# EAGLE design SerialDev-2232-1A (EAGLE 7.3.0)
Assembly variants: ScreenWatch, ScreenCheck, ScreenWatchEco, SX2-BMG
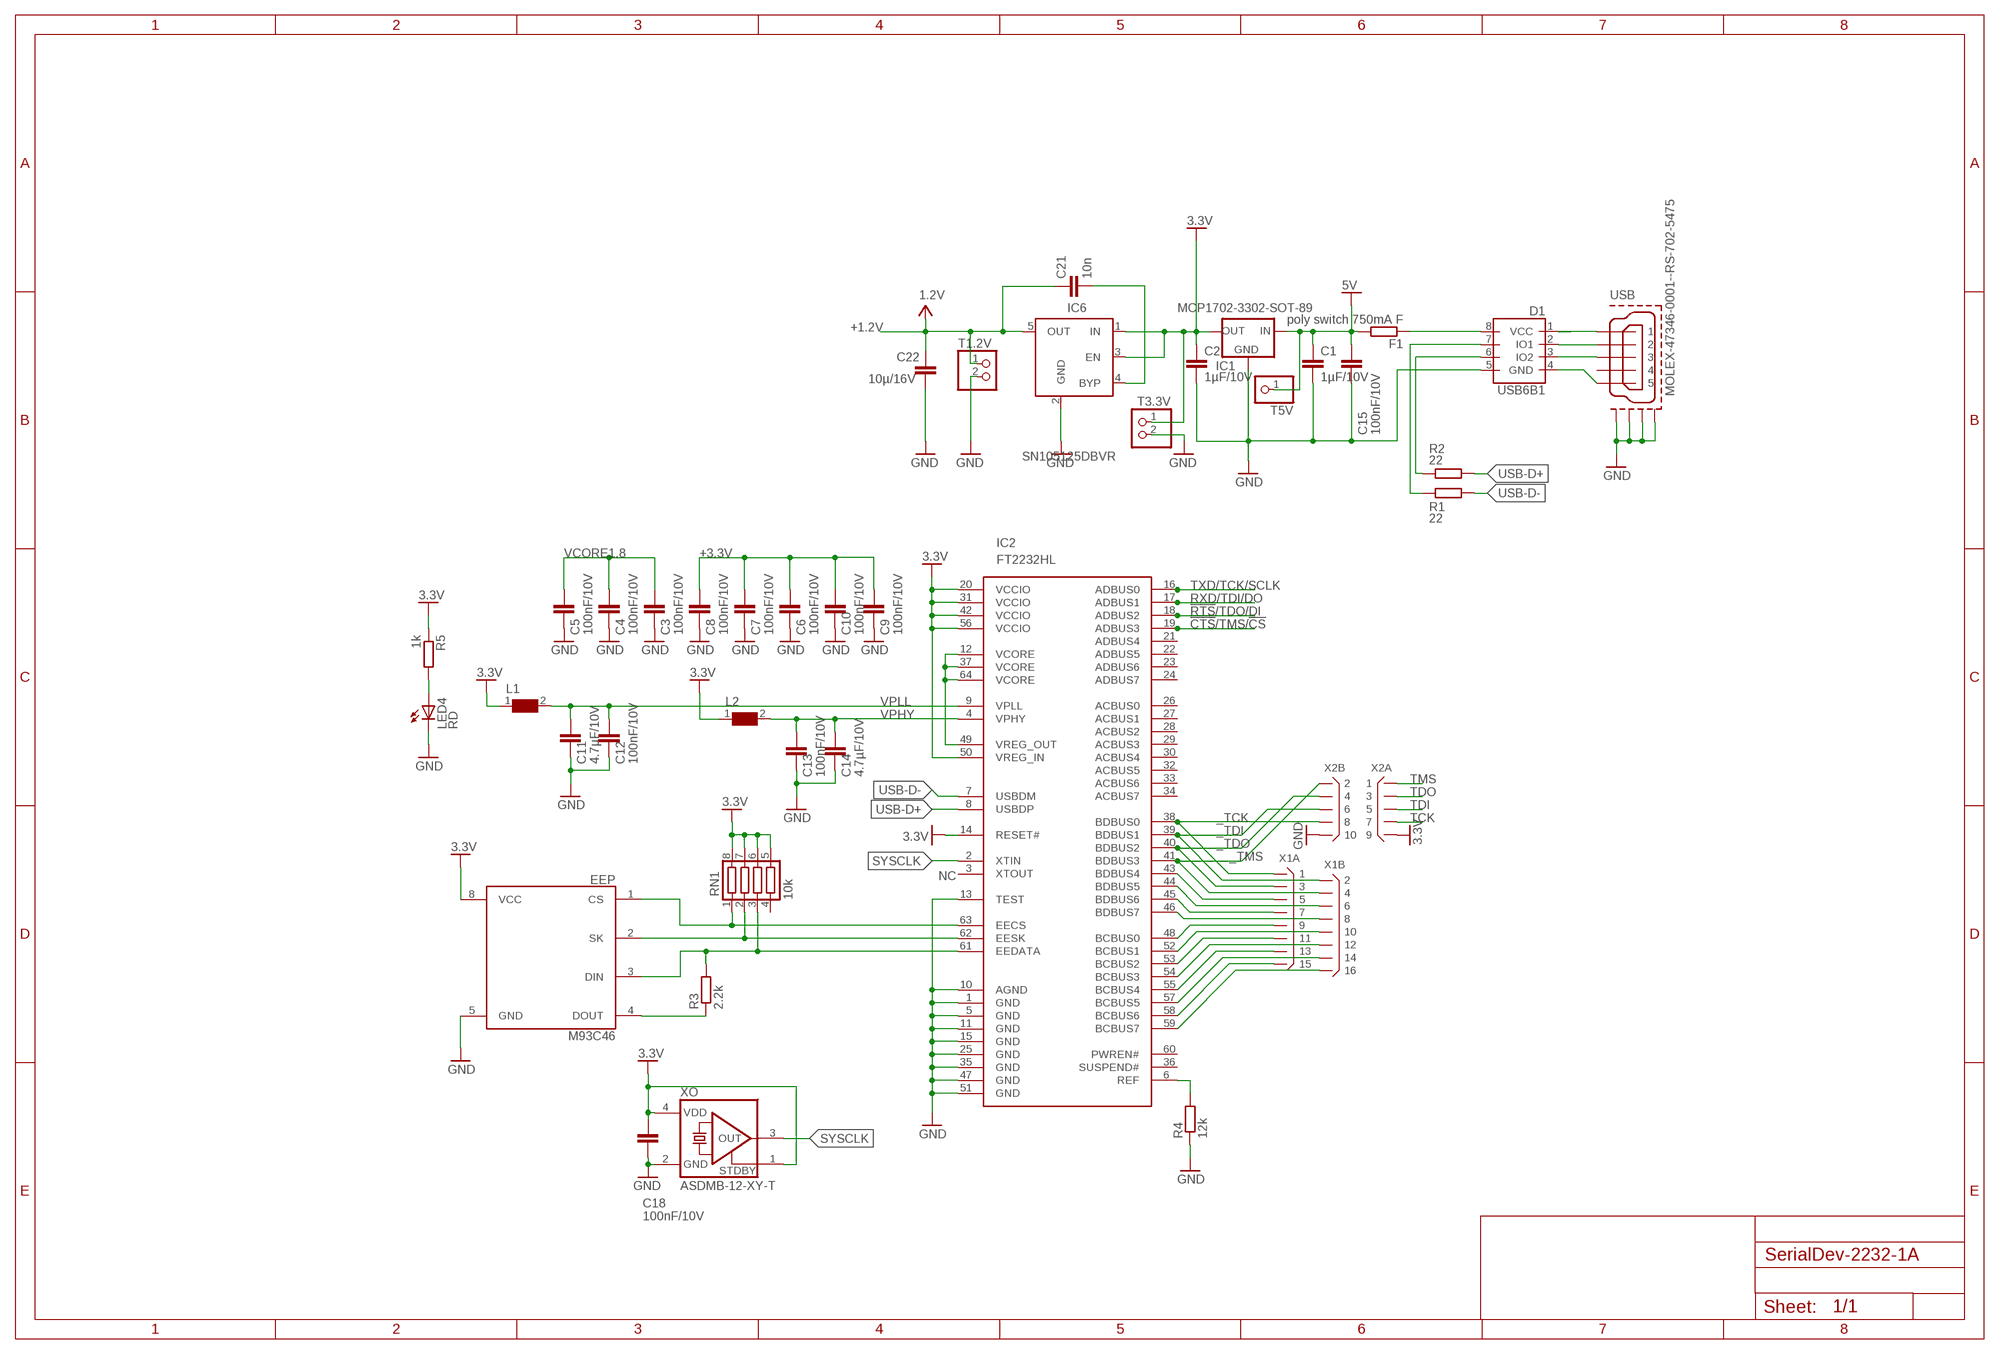
[diagram p0: schematic, sheet 1]

## Parts
C1  1µF/10V  C-EUC0805K  [C0805K]  (not fitted in variant ScreenCheck)  (not fitted in variant SX2-BMG)
C2  1µF/10V  C-EUC0805K  [C0805K]
C3  100nF/10V  C-EUC0402K  [C0402K]
C4  100nF/10V  C-EUC0402K  [C0402K]
C5  100nF/10V  C-EUC0402K  [C0402K]
C6  100nF/10V  C-EUC0402K  [C0402K]
C7  100nF/10V  C-EUC0402K  [C0402K]
C8  100nF/10V  C-EUC0402K  [C0402K]
C9  100nF/10V  C-EUC0402K  [C0402K]
C10  100nF/10V  C-EUC0402K  [C0402K]
C11  4.7µF/10V  C-EUC0402K  [C0402K]
C12  100nF/10V  C-EUC0402K  [C0402K]
C13  100nF/10V  C-EUC0402K  [C0402K]
C14  4.7µF/10V  C-EUC0402K  [C0402K]
C15  100nF/10V  C-EUC0402K  [C0402K]
C18  100nF/10V  C-EUC0402K  [C0402K]
C21  10n  C-EUC0805K  [C0805K]
C22  10µ/16V  C-EUC0805K  [C0805K]
D1  USB6B1  [SO08]
EEP  M93C46  [SO08]
F1  poly switch 750mA F  R-EU_R1206  [R1206]
IC1  MCP1702-3302-SOT-89  [SOT89-R]  (not fitted in variant ScreenCheck)  (not fitted in variant SX2-BMG)
IC2  FT2232HL  [LQFP-ST-64-2]
IC6  SN105125DBVR  MIC5219XX  [SOT23-5]
L1  WE-CBF_0603  [0603]
L2  WE-CBF_0603  [0603]
LED4  RD  LEDCHIP-LED0805  [CHIP-LED0805]  (not fitted in variant ScreenWatch)  (not fitted in variant ScreenWatchEco)
R1  22  R-EU_R0603  [R0603]  (not fitted in variant ScreenWatch)  (not fitted in variant ScreenWatchEco)
R2  22  R-EU_R0603  [R0603]  (not fitted in variant ScreenWatch)  (not fitted in variant ScreenWatchEco)
R3  2.2k  R-EU_R0603  [R0603]
R4  12k  R-EU_R0603  [R0603]
R5  1k  R-EU_R0603  [R0603]  (not fitted in variant ScreenWatch)  (not fitted in variant ScreenWatchEco)
RN1  10k  CTS742C083  [CTS742C083]
T1.2V  PINHD-1X2  [1X02]
T3.3V  PINHD-1X2  [1X02]
T5V  PINHD-1X1  [1X01]
USB  MOLEX-47346-0001--RS-702-5475  MOLEX-47346-0001  [MOLEX-47364-0001]  (not fitted in variant ScreenWatch)  (not fitted in variant ScreenWatchEco)  (not fitted in variant SX2-BMG)
X1  X08X2IR  [X16R-IDC]
X2  X05X2DR  [X10R-DIL]
XO  ASDMB-12-XY-T  XTAL-ASDMB  [XO-4-2.5X2.0]

## Nets
!CTS!/TMS/!CS!: IC2.19(ADBUS3)
!RTS!/TDO/DI: IC2.18(ADBUS2)
+1.2V: C21.1 C22.1 IC6.5(OUT) T1.2V.1 ; supply symbol labelled 1.2V
+3.3V: C2.1 C6.1 C7.1 C8.1 C9.1 C10.1 C18.1 EEP.8(VCC) IC1.3(OUT) IC2.14(RESET#) IC2.20(VCCIO) IC2.31(VCCIO) IC2.42(VCCIO) IC2.50(VREG_IN) IC2.56(VCCIO) IC6.1(IN) IC6.3(EN) L1.1 L2.1 R5.1 RN1.5 RN1.6 RN1.7 RN1.8 T3.3V.1 X2.9 XO.1(TRI) XO.4(VDD) ; supply symbol labelled 3.3V
+5V: C1.1 C15.1 F1.2 IC1.2(IN) IC1.4(IN) T5V.1 ; supply symbol labelled 5V
_TCK: IC2.38(BDBUS0) X1.1 X2.8
_TDI: IC2.39(BDBUS1) X1.2 X2.6
_TDO: IC2.40(BDBUS2) X1.3 X2.4
_TMS: IC2.41(BDBUS3) X1.4 X2.2
GND [copper pour GND]: C1.2 C2.2 C3.2 C4.2 C5.2 C6.2 C7.2 C8.2 C9.2 C10.2 C11.2 C12.2 C13.2 C14.2 C15.2 C18.2 C22.2 D1.5(GND) EEP.5(GND) IC1.1(GND) IC2.1(GND) IC2.5(GND) IC2.10(AGND) IC2.11(GND) IC2.13(TEST) IC2.15(GND) IC2.25(GND) IC2.35(GND) IC2.47(GND) IC2.51(GND) IC6.2(GND) LED4.C R4.1 T1.2V.2 T3.3V.2 USB.GND1 USB.GND2 USB.GND3 USB.GND4 X2.10 XO.2(GND)
N$1: EEP.1(CS) IC2.63(EECS) RN1.1
N$2 [USB]: D1.6(IO2) R2.1
N$3 [USB]: D1.7(IO1) R1.2
N$4: EEP.2(SK) IC2.62(EESK) RN1.2
N$5: EEP.3(DIN) IC2.61(EEDATA) R3.2 RN1.3
N$6: EEP.4(DOUT) R3.1
N$7: D1.4(GND) USB.5
N$8: D1.3(IO2) USB.3
N$9: IC2.6(REF) R4.2
N$10: D1.2(IO1) USB.2
N$11: D1.8(VCC) F1.1
N$12: C21.2 IC6.4(BYP)
N$14: LED4.A R5.2
N$18: IC2.43(BDBUS4) X1.5
N$19: IC2.44(BDBUS5) X1.6
N$20: IC2.45(BDBUS6) X1.7
N$21: IC2.46(BDBUS7) X1.8
N$22: IC2.48(BCBUS0) X1.9
N$23: IC2.52(BCBUS1) X1.10
N$24: IC2.53(BCBUS2) X1.11
N$25: IC2.54(BCBUS3) X1.12
N$26: IC2.55(BCBUS4) X1.13
N$27: IC2.57(BCBUS5) X1.14
N$28: IC2.58(BCBUS6) X1.15
N$29: IC2.59(BCBUS7) X1.16
RXD/TDI/DO: IC2.17(ADBUS1)
SYSCLK: IC2.2(XTIN) XO.3(OUT)
TCK: X2.7
TDI: X2.5
TDO: X2.3
TMS: X2.1
TXD/TCK/SCLK: IC2.16(ADBUS0)
USB-D+ [USB]: IC2.8(USBDP) R2.2
USB-D- [USB]: IC2.7(USBDM) R1.1
USB_5V: D1.1(VCC) USB.1
VCORE1.8: C3.1 C4.1 C5.1 IC2.12(VCORE) IC2.37(VCORE) IC2.49(VREG_OUT) IC2.64(VCORE)
VPHY: C13.1 C14.1 IC2.4(VPHY) L2.2
VPLL: C11.1 C12.1 IC2.9(VPLL) L1.2
Unconnected: IC2.3(XTOUT) IC2.21(ADBUS4) IC2.22(ADBUS5) IC2.23(ADBUS6) IC2.24(ADBUS7) IC2.26(ACBUS0) IC2.27(ACBUS1) IC2.28(ACBUS2) IC2.29(ACBUS3) IC2.30(ACBUS4) IC2.32(ACBUS5) IC2.33(ACBUS6) IC2.34(ACBUS7) IC2.36(SUSPEND#) IC2.60(PWREN#) RN1.4 USB.4

## Notes on the sheet
- NC

## Library data of the parts
C1 C2 = rcl:C-EU: CAPACITOR, European symbol
C3-C15 C18 = rcl:C-EU: CAPACITOR, European symbol; MOUSER: 810-C1005X7R1H104K
C21 = rcl:C-EU: CAPACITOR, European symbol; PARTNO: Kemet: C1206C103K5RACTU; VALUE2: 50V/X7R; VALUE3: Farnell: 1414713
C22 = rcl:C-EU: CAPACITOR, European symbol; PARTNO: Vishay Sprague: TR3B106K016C0800; VALUE2: 16V/10%; VALUE3: Farnell: 1754085; VALUE4: Wird mit Bauform B bestückt
D1 = st-microelectronics:USB6B1: DATA LINES PROTECTION Source: http://www.st.com/stonline/products/literature/ds/5605.pdf; MPN: USB6B1; OC_FARNELL: 9804358; OC_NEWARK: 26M4750
EEP = SparkFun-DigitalIC:M93C46: 1kbit SPI EEPROM
F1 R1-R5 = rcl:R-EU_: RESISTOR, European symbol
IC1 = MCP1702:MCP1702-
IC2 = custom-parts:FT2232H: FT2232H DUAL HIGH SPEED USB TO MULTIPURPOSE UART/FIFO IC Datasheet http://www.ftdichip.com/Documents/DataSheets/ICs/DS_FT2232H.pdf; FARNELL: 1697461; MOUSER: 895-FT2232HL
IC6 = v-reg-micrel:MIC5219XX: VOLTAGE REGULATOR; PARTNO: LINEAR TECHNOLOGY: LT1761ES5-1.2; VALUE3: Farnell: 2102605
L1 L2 = EagleLibrary_Wuerth_Elektronik_eiSos_V6_20140807:WE-CBF: SMD EMI Suppression Ferrite Beads WE-CBF - Excellent anti-EMI properties - Low DC-restistance - Impedances till 3000 ohms - Rated current up to 6 A -- Reliable Ni-Sn electrodes -- Perfect as data lined filter and for uncoupling of distribution voltage <http://katalog.we-online.de/media/images/eisos/FeCBF_pf2.jpg> Details see: http://katalog.we-online.de/en/pbs/WE-CBF updated by Dan Xu 2014-06-19 2014 (C) Würth Elektronik
LED4 = led:LED: LED OSRAM: - CHIPLED LG R971, LG N971, LY N971, LG Q971, LY Q971, LO R971, LY R971 LH N974, LH R974 LS Q976, LO Q976, LY Q976 LO Q996 - Hyper CHIPLED LW Q18S LB Q993, LB Q99A, LB R99A - SideLED LS A670, LO A670, LY A670, LG A670, LP A670 LB A673, LV A673, LT A673, LW A673 LH A674 LY A675 LS A676, LA A676, LO A676, LY A676, LW A676 LS A679, LY A679, LG A679 - Hyper Micro SIDELED® LS Y876, LA Y876, LO Y876, LY Y876 LT Y87S - SmartLED LW L88C, LW L88S LB L89C, LB L89S, LG L890 LS L89K, LO L89K, LY L89K LS L896, LA L896, LO L896, LY L896 - TOPLED LS T670, LO T670, LY T670, LG T670, LP T670 LSG T670, LSP T670, LSY T670, LOP T670, LYG T670 LG T671, LOG T671, LSG T671 LB T673, LV T673, LT T673, LW T673 LH T674 LS T676, LA T676, LO T676, LY T676, LB T676, LH T676, LSB T676, LW T676 LB T67C, LV T67C, LT T67C, LS T67K, LO T67K, LY T67K, LW E67C LS E67B, LA E67B, LO E67B, LY E67B, LB E67C, LV E67C, LT E67C LW T67C LS T679, LY T679, LG T679 LS T770, LO T770, LY T770, LG T770, LP T770 LB T773, LV T773, LT T773, LW T773 LH T774 LS E675, LA E675, LY E675, LS T675 LS T776, LA T776, LO T776, LY T776, LB T776 LHGB T686 LT T68C, LB T68C - Hyper Mini TOPLED® LB M676 - Mini TOPLED Santana® LG M470 LS M47K, LO M47K, LY M47K Source: http://www.osram.convergy.de LUXEON: - LUMILED® LXK2-PW12-R00, LXK2-PW12-S00, LXK2-PW14-U00, LXK2-PW14-V00 LXK2-PM12-R00, LXK2-PM12-S00, LXK2-PM14-U00 LXK2-PE12-Q00, LXK2-PE12-R00, LXK2-PE12-S00, LXK2-PE14-T00, LXK2-PE14-U00 LXK2-PB12-K00, LXK2-PB12-L00, LXK2-PB12-M00, LXK2-PB14-N00, LXK2-PB14-P00, LXK2-PB14-Q00 LXK2-PR12-L00, LXK2-PR12-M00, LXK2-PR14-Q00, LXK2-PR14-R00 LXK2-PD12-Q00, LXK2-PD12-R00, LXK2-PD12-S00 LXK2-PH12-R00, LXK2-PH12-S00 LXK2-PL12-P00, LXK2-PL12-Q00, LXK2-PL12-R00 Source: www.luxeon.com KINGBRIGHT: KA-3528ASYC Source: www.kingbright.com
RN1 = resistor-net:CTS742C083: Chip Resistor Array 4 Single Resistor Source: http://www.ctscorp.com/components/Datasheets/CTSChipArrayDs.pdf; OC_FARNELL: unknown; OC_NEWARK: unknown
T1.2V T3.3V = pinhead:PINHD-1X2: PIN HEADER
T5V = pinhead:PINHD-1X1: PIN HEADER
USB = usb_con-update:MOLEX-47346-0001: MICRO USB B, BOTTOM MOUNT
X1 = connectors:X08X2: Connector 2x8 pins
X2 = connectors:X05X2: Connector 2x5 pins
XO = custom-parts:XTAL: INDUSTRIAL GRADE ULTRA MINIATURE 7.0 x 5.0 x 0.85 mm PURE SILICONTM CLOCK OSCILLATOR Features Pure Silicon™ Clock Oscillator 2nd Generation MEMS Technology with reduced jitter by Discera Low Power Consumption <10mA Exceptional Stability +/- 10ppm Over Temp. at -40 to +105°C Capable of surviving up-to 30kg Mechanical Shock (see note #1) Compact QFN Plastic Packaging Datasheet http://www.mouser.com/ds/2/3/ASVMB-35165.pdf; MFG: ABRACON; MFG_PARTNO: ASDMB-12.000MHZ-XY-T; MOUSER: 815-ASDMB-12-XY-T

## Net classes
0 default: width 0.2 mm, drill 0.3 mm, clearance 0.15 mm
1 copper pour GND: width 0.2 mm, drill 0.3 mm, clearance 0.15 mm to class 0, clearance 0.15 mm
2 copper pour +5V: width 0.2 mm, drill 0.3 mm, clearance 0.15 mm to class 0, clearance 0.15 mm to class 1, clearance 0.15 mm
3 USB: width 0.203 mm, drill 0.3 mm, clearance 0.508 mm to class 0, clearance 0.508 mm to class 1, clearance 0.508 mm to class 2, clearance 0.305 mm

## Board
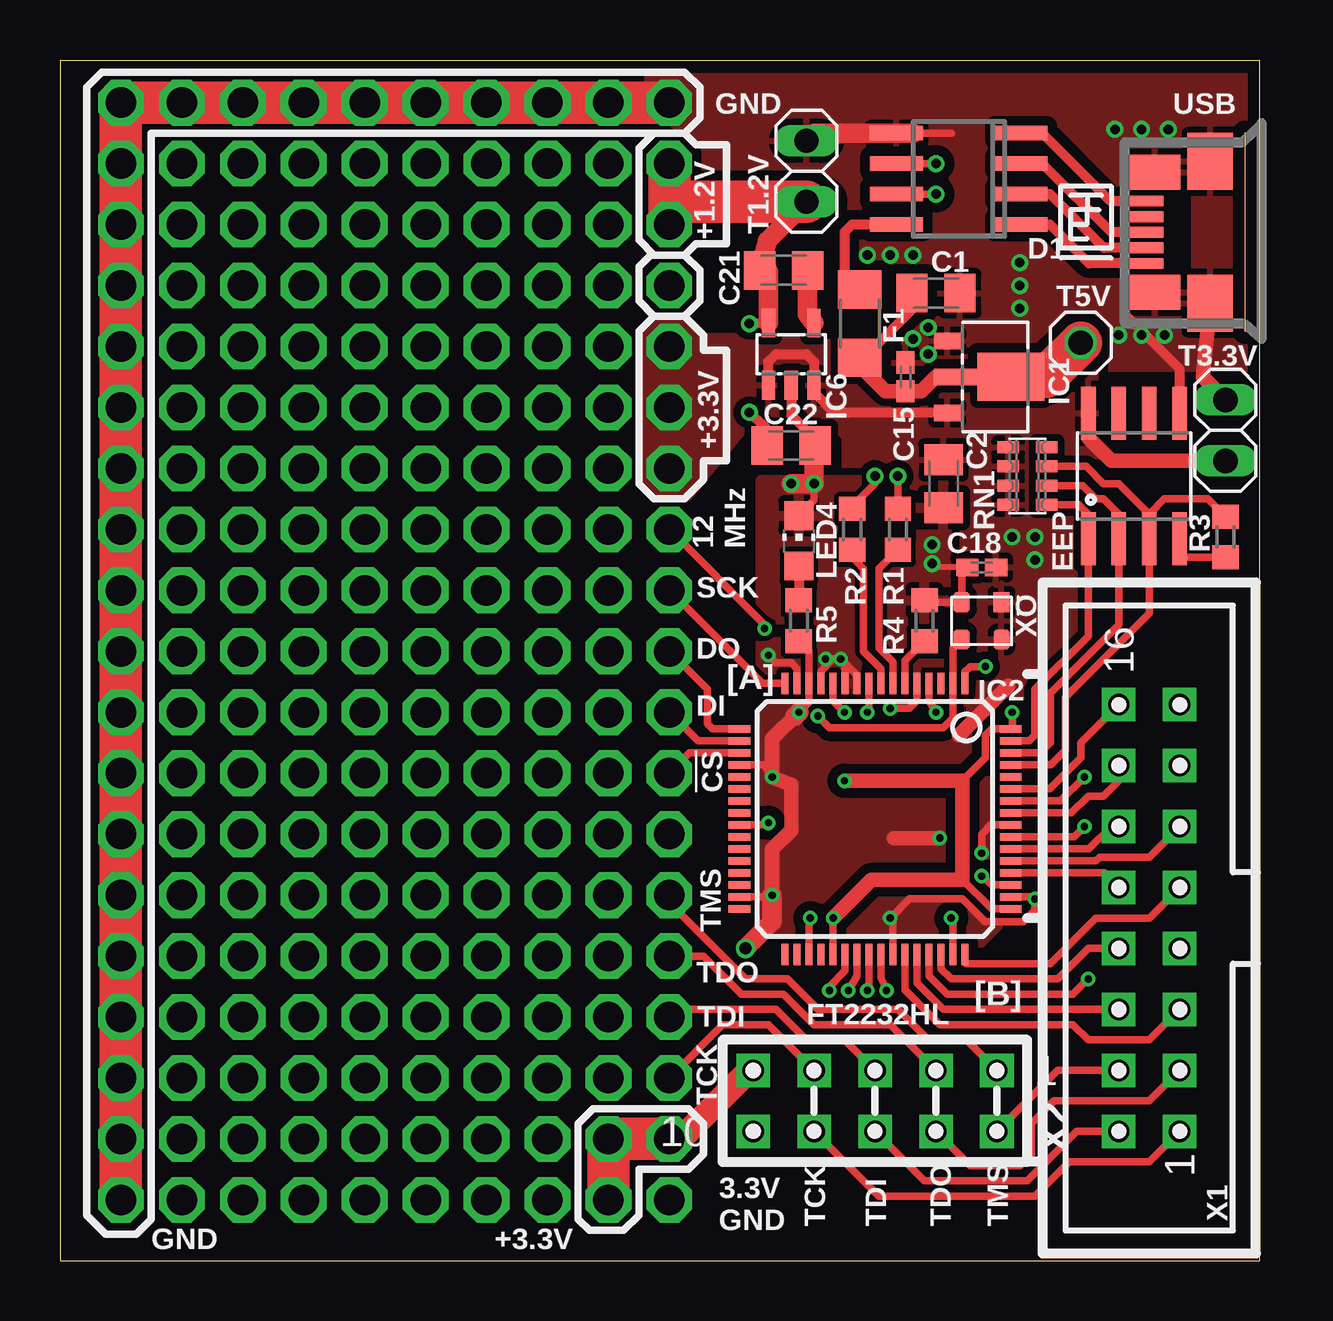
[diagram p1: board, top side]
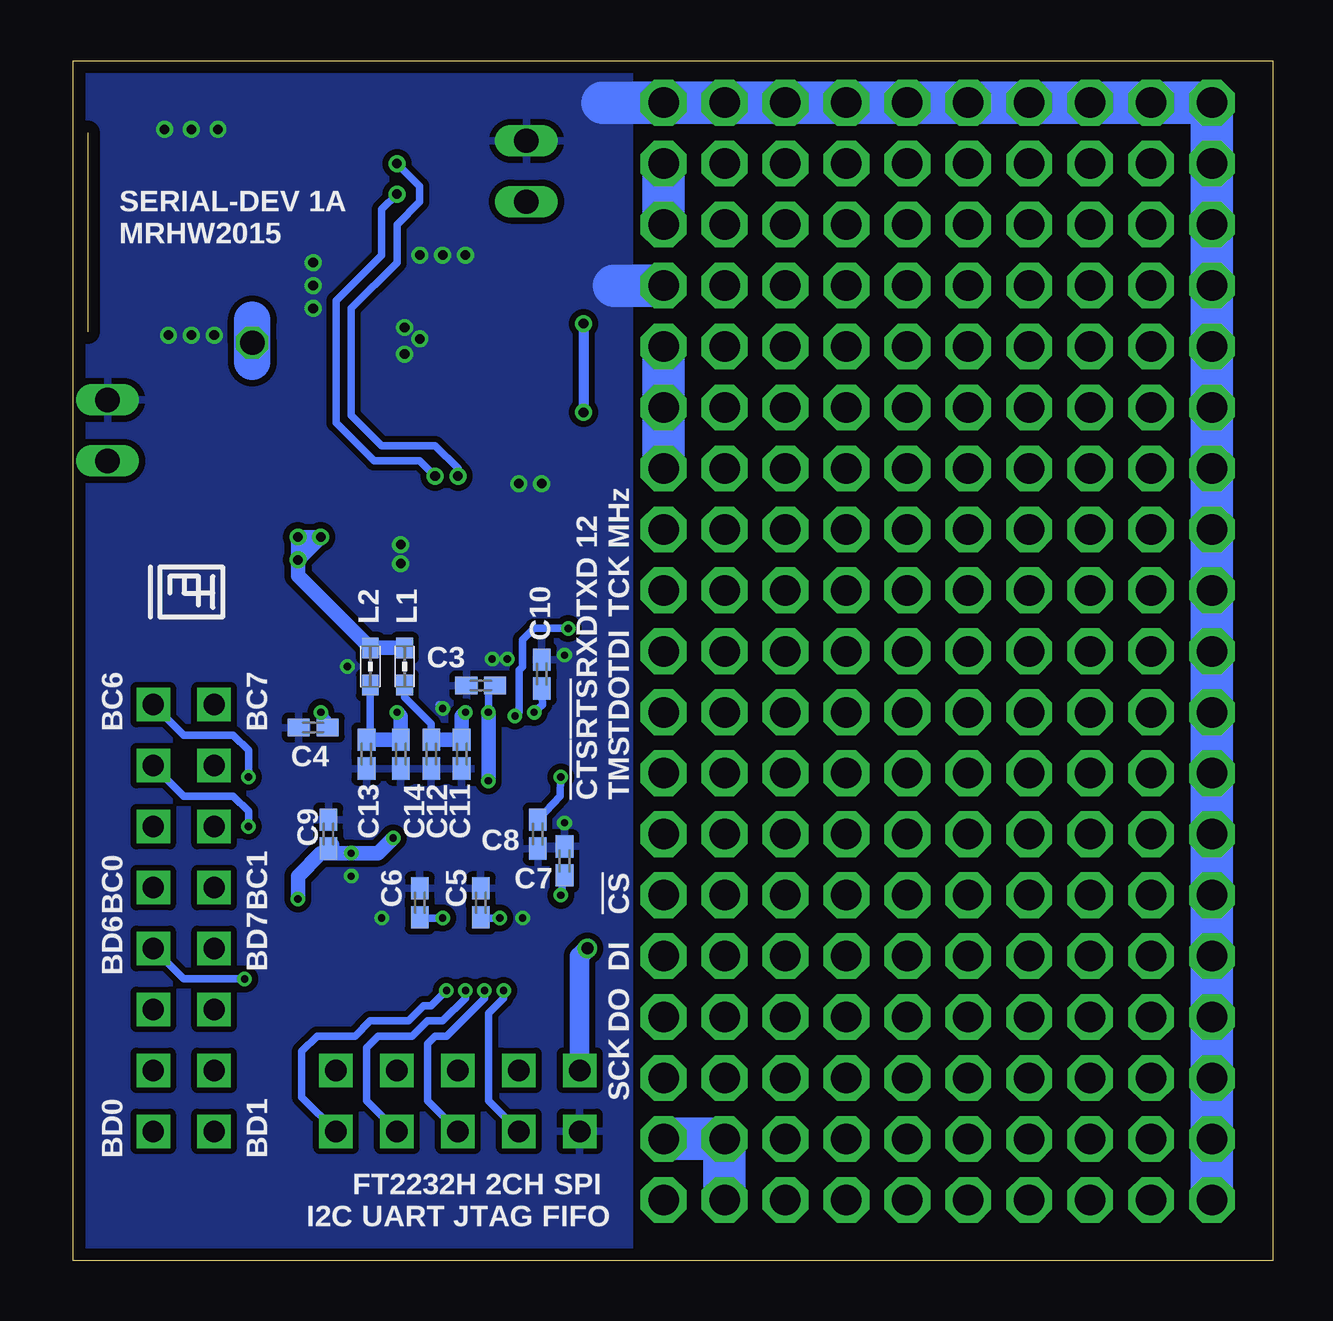
[diagram p2: board, bottom side, seen from below]

Size 50 x 50 mm. Coordinates in mm from the lower left corner, seen from the top.
Outline: 0,0 50,0 50,50 0,50 0,0
Copper layers (1*16): Top 0.035mm / dielectric 1.5mm / Bottom 0.035mm
Design rules "default *": minimum track width 10mil, minimum drill 0.3mm, track to track 8mil, track to pad 8mil, pad to pad 8mil, via to via 8mil, smd to smd 8mil, copper to edge 20mil, drill to drill 8mil, minimum pad ring 6mil, minimum via ring 6mil, stop-mask expansion 1mil, vias tented up to drill 0.4mm, thermal gap 10mil

### Footprints (pad centres in the part's own frame; a part is rotated, then mirrored left to right if it is on the bottom)
C0805K = smd 1.3 x 1.6: 1 -1,0; 2 1,0
C0402K = smd 0.925 x 0.74: 1 -0.6,0; 2 0.6,0
SO08 = smd 0.6 x 2.2: 1 -1.905,-2.6; 2 -0.635,-2.6; 3 0.635,-2.6; 4 1.905,-2.6; 5 1.905,2.6; 6 0.635,2.6; 7 -0.635,2.6; 8 -1.905,2.6
SO08' = smd 0.61 x 2.21: 1 -1.905,-2.616; 2 -0.635,-2.616; 3 0.635,-2.616; 4 1.905,-2.616; 5 1.905,2.616; 6 0.635,2.616; 7 -0.635,2.616; 8 -1.905,2.616
R1206 = smd 1.6 x 1.803: 1 -1.422,0; 2 1.422,0
SOT89-R = smd 0.7 x 1.1: 1 -1.5,-1.75; 3 1.5,-1.75 | smd 0.7 x 1.8: 2 0,-1.4 | smd 2 x 2.8: 4 0,0.9
LQFP-ST-64-2 = smd 0.9 x 0.3: 1 -5.65,3.75; 2 -5.65,3.25; 3 -5.65,2.75; 4 -5.65,2.25; 5 -5.65,1.75; 6 -5.65,1.25; 7 -5.65,0.75; 8 -5.65,0.25; 9 -5.65,-0.25; 10 -5.65,-0.75; 11 -5.65,-1.25; 12 -5.65,-1.75; 13 -5.65,-2.25; 14 -5.65,-2.75; 15 -5.65,-3.25; 16 -5.65,-3.75; 33 5.65,-3.75; 34 5.65,-3.25; 35 5.65,-2.75; 36 5.65,-2.25; 37 5.65,-1.75; 38 5.65,-1.25; 39 5.65,-0.75; 40 5.65,-0.25; 41 5.65,0.25; 42 5.65,0.75; 43 5.65,1.25; 44 5.65,1.75; 45 5.65,2.25; 46 5.65,2.75; 47 5.65,3.25; 48 5.65,3.75 | smd 0.3 x 0.9: 17 -3.75,-5.65; 18 -3.25,-5.65; 19 -2.75,-5.65; 20 -2.25,-5.65; 21 -1.75,-5.65; 22 -1.25,-5.65; 23 -0.75,-5.65; 24 -0.25,-5.65; 25 0.25,-5.65; 26 0.75,-5.65; 27 1.25,-5.65; 28 1.75,-5.65; 29 2.25,-5.65; 30 2.75,-5.65; 31 3.25,-5.65; 32 3.75,-5.65; 49 3.75,5.65; 50 3.25,5.65; 51 2.75,5.65; 52 2.25,5.65; 53 1.75,5.65; 54 1.25,5.65; 55 0.75,5.65; 56 0.25,5.65; 57 -0.25,5.65; 58 -0.75,5.65; 59 -1.25,5.65; 60 -1.75,5.65; 61 -2.25,5.65; 62 -2.75,5.65; 63 -3.25,5.65; 64 -3.75,5.65
SOT23-5 = smd 0.55 x 1.2: 1 -0.95,-1.3; 2 0,-1.3; 3 0.95,-1.3; 4 0.95,1.3; 5 -0.95,1.3
0603 = smd 0.85 x 0.7: 1 -0.775,0; 2 0.775,0
CHIP-LED0805 = smd 1.2 x 1.2: A 0,-1.05; C 0,1.05
R0603 = smd 1 x 1.1: 1 -0.85,0; 2 0.85,0
CTS742C083 = smd 0.5 x 0.9: 1 -1.2,-0.8; 2 -0.4,-0.8; 3 0.4,-0.8; 4 1.2,-0.8; 5 1.2,0.8; 6 0.4,0.8; 7 -0.4,0.8; 8 -1.2,0.8
1X02 = drill 1.016 long: 1 -1.27,0; 2 1.27,0
1X01 = drill 1.016 octagon: 1 0,0
MOLEX-47364-0001 = smd 1.7 x 0.45: 1 2.8,1.3; 2 2.8,0.65; 3 2.8,0; 4 2.8,-0.65; 5 2.8,-1.3 | smd 1.9 x 2.375: GND1 0,2.95; GND4 0,-2.95 | smd 2.1 x 1.475: GND2 2.3,2.5; GND3 2.3,-2.5
X16R-IDC = drill 0.889 pad 1.397 square: 1 -8.89,-1.27; 2 -8.89,1.27; 3 -6.35,-1.27; 4 -6.35,1.27; 5 -3.81,-1.27; 6 -3.81,1.27; 7 -1.27,-1.27; 8 -1.27,1.27; 9 1.27,-1.27; 10 1.27,1.27; 11 3.81,-1.27; 12 3.81,1.27; 13 6.35,-1.27; 14 6.35,1.27; 15 8.89,-1.27; 16 8.89,1.27
X10R-DIL = drill 0.889 pad 1.397 square: 1 -5.08,-1.27; 2 -5.08,1.27; 3 -2.54,-1.27; 4 -2.54,1.27; 5 0,-1.27; 6 0,1.27; 7 2.54,-1.27; 8 2.54,1.27; 9 5.08,-1.27; 10 5.08,1.27
XO-4-2.5X2.0 = smd 0.66 x 0.838: 1 -0.826,-0.775; 2 0.826,-0.775; 3 0.826,0.775; 4 -0.826,0.775

### Placement (x,y rotation side)
C1  36.51,40.32 0 top
C2  36.83,32.38 270 top
C3  33.02,23.97 180 bottom
C4  40.01,22.23 180 bottom
C5  33.02,14.92 90 bottom
C6  35.56,14.92 90 bottom
C7  29.53,16.67 90 bottom
C8  30.64,17.78 270 bottom
C9  39.37,17.78 90 bottom
C10  30.48,24.45 90 bottom
C11  33.81,21.11 270 bottom
C12  35.08,21.11 270 bottom
C13  37.78,21.11 270 bottom
C14  36.35,21.11 270 bottom
C15  35.24,36.83 90 top
C18  38.42,28.89 180 top
C21  30.16,41.27 0 top
C22  30.48,33.97 0 top
D1  37.47,45.09 90 top
EEP  M93C46  [SO08']  44.77,32.7 0 top
F1  33.34,39.05 270 top
IC1  38.73,36.83 270 top
IC2  33.97,18.41 270 top
IC6  30.48,37.78 0 top
L1  36.2,24.77 270 bottom
L2  37.62,24.77 270 bottom
LED4  30.8,30 0 top
R1  34.92,30.48 90 top
R2  33.02,30.48 270 top
R3  48.58,30.16 90 top
R4  36.04,26.67 270 top
R5  30.8,26.67 90 top
RN1  40.32,32.7 90 top
T1.2V  31.11,45.4 90 top
T3.3V  48.58,34.61 90 top
T5V  42.55,38.26 0 top
U$1  [DESIGNER]  46.35,28.89 270 bottom
U$2  [DESIGNER]  41.75,42.23 0 top
USB  47.94,42.86 180 top
X1  45.4,14.29 90 top
X2  33.97,6.67 180 top
XO  38.42,26.67 180 top

### Tracks (layer width: path | path; a pad name or v marks a point on that pad's centre or on a via)
!CTS!/TMS/!CS!  (via drill 1.27 pad 1.91)
  Top 0.305: IC2.19 26.25,21.16 v25.4,20.32
!RTS!/TDO/DI  (via drill 1.27 pad 1.91)
  Top 0.305: IC2.18 26.59,21.66 v25.4,22.86
+1.2V  (via drill 0.4, 1.27 pad 1.91)
  Top 0.406: IC6.5 v28.74,39.05 | v28.73,35.35 29.37,34.77 29.48,34.66 C22.1
  Top 0.813: T1.2V.1 29.48,42.5 C21.1 29.53,41.23 IC6.5
  Top 1.778: T1.2V.1 25.4,44.13 v25.4,43.18 v25.4,45.72
  Bottom 0.406: v28.74,39.05 28.73,37.78 v28.73,35.35
  Bottom 1.778: v25.4,43.18 v25.4,45.72
+3.3V  (via drill 0.3, 0.4, 0.5, 1.27 pad 1.91)
  Top 0.305: IC2.42 34.72,14.17 v34.61,14.29 35.4,15.08 37.62,15.08 38.58,14.13 40.16,14.13 40.64,14.61 v40.64,15.08 40.56,15.16 IC2.50 | R5.1 31.22,25.39 IC2.14 31.22,23.29 v30.8,22.86 | IC2.31 29.61,15.16 v29.69,15.24 | IC2.20 29.34,20.66 v29.69,20.16 | v38.42,16.99 38.42,17.78 38.8,18.16 IC2.56
  Top 0.406: IC6.1 29.53,37.47 29.84,37.78 31.11,37.78 31.43,37.47 IC6.3 31.43,36.2 32.27,35.33 IC1.3
  Top 0.61: T3.3V.1 43.81,33.34 42.86,34.29 EEP.8 | v30.8,22.86 29.69,21.75 v29.69,20.16 30.48,19.84 30.48,17.94 29.69,17.14 v29.69,15.24 | 37.47,21.91 39.53,23.97 | v36.67,17.62 34.77,17.62
  Top 0.813: v28.57,13.02 29.69,14.13 v29.69,15.24 | 30.64,22.7 v30.8,22.86
  Top 1.016: v25.4,5.08 25.88,5.08 28.73,7.94 X2.9
  Top 1.778: v22.86,2.54 v22.86,5.08 v25.4,5.08
  Bottom 0.305: v34.61,14.29 35.52,14.29 C6.1 | v29.69,15.24 C7.1 | v30.8,22.86 30.45,23.18 C10.1 | v29.69,20.16 29.72,19.37 C8.1
  Bottom 0.61: v40.64,15.08 40.64,16.03 39.69,16.99 39.53,16.99 | 39.37,16.99 v38.42,16.99 37.31,16.99 v36.67,17.62 | C9.1 39.21,17.14 | 39.21,17.14 39.53,16.99 | 39.21,17.14 39.37,16.99 | 39.37,16.99 39.53,16.99 | v40.64,29.21 40.64,28.56 L2.1 L1.1 | v40.64,29.21 v40.64,30.16 v39.69,30.16 v40.64,29.21 | 39.21,17.14 39.21,17.34
  Bottom 0.813: X2.9 28.89,12.7 v28.57,13.02
  Bottom 1.778: v25.4,38.1 v25.4,33.02 | v22.86,2.54 v22.86,5.08 v25.4,5.08
  other vias: 25.4,35.56
  pour Top (isolate 0.305, rank 3): 32.7,37.15 43.18,37.15 43.18,26.19 40.16,23.18 37.62,23.18 37.62,30.8 32.7,30.8 32.7,34.29 31.75,35.24 29.05,35.24 26.19,31.75 24.92,31.75 24.13,32.54 24.13,38.58 24.92,39.37 26.04,39.37 26.83,38.58 31.91,38.58 32.7,37.78
  pour Top (isolate 0.406, rank 3): 28.42,21.91 28.42,15.08 30.32,13.18 38.42,13.18 39.21,13.97 39.21,23.02 38.26,23.97 30.48,23.97
+5V
  Top 0.406: 36.51,36.83 IC1.2 | IC1.4 40.3,37.5 | C1.1 35.51,39.64 33.34,37.47 F1.2
  Top 0.61: F1.2 33.34,37.31 34.41,36.23 C15.1 35.91,36.23 36.51,36.83 | IC1.4 IC1.2
  Top 1.778: T5V.1 41.12,36.83 IC1.4
  Bottom 1.524: 42.55,37.47 T5V.1 42.55,39.21
_TCK  (via drill 0.3)
  Top 0.305: X1.1 45.4,4.13 42.07,4.13 40.64,2.7 34.13,2.7 X2.8 | IC2.38 32.72,12.09 32.07,11.43 v32.07,11.27
  Bottom 0.305: v32.07,11.27 32.07,10.95 32.7,10.32 32.7,6.67 X2.8
_TDI  (via drill 0.3)
  Top 0.305: X1.2 42.39,5.4 40.32,3.33 36.04,3.33 X2.6 | IC2.39 33.22,11.86 v32.86,11.27
  Bottom 0.305: v32.86,11.27 32.86,10.95 34.45,9.37 34.92,9.37 35.24,9.05 35.24,6.67 X2.6
_TDO  (via drill 0.3)
  Top 0.305: X1.3 45.4,6.67 41.43,6.67 40.48,5.71 40.48,4.45 40.01,3.97 37.94,3.97 X2.4 | IC2.40 33.72,11.52 v33.66,11.27
  Bottom 0.305: v33.66,11.27 33.66,10.95 34.61,10 35.24,10 35.88,9.37 37.31,9.37 37.78,8.89 37.78,6.67 X2.4
_TMS  (via drill 0.3)
  Top 0.305: IC2.41 34.22,11.81 v34.45,11.27 | X1.4 41.59,7.94 X2.2
  Bottom 0.305: v34.45,11.27 35.08,10.64 35.4,10.64 36.04,10 37.62,10 38.26,9.37 39.85,9.37 40.48,8.73 40.48,6.83 X2.2
GND  (via drill 0.3, 0.4, 1.27 pad 1.91)
  Top 0.254: C18.2 36.51,28.89 v36.35,29.05
  Top 0.305: R4.1 35.63,27.45 XO.2 37.59,28.67 C18.2 | D1.5 35.56,46.99 37.15,46.99 | IC2.35 31.22,14.24 v31.27,14.29 | IC2.47 37.22,14.21 v37.15,14.29 | IC2.51 38.84,15.66 v38.42,16.03 | C22.2 31.43,33.92 | LED4.C 31.43,31.69 v31.43,32.38 | IC2.25 29.44,18.16 v29.53,18.26 | IC2.11 32.72,24.9 v32.54,25.08 | IC2.10 33.22,24.4 v32.54,25.08 | v32.54,25.08 32.23,25.08 31.72,24.58 IC2.13 | IC2.15 30.72,24.68 30.48,24.92 29.84,24.92 v29.53,25.24 | IC2.5 35.72,23.34 35.4,23.02 v34.61,23.02 | IC2.1 37.72,24.55 37.94,24.77 v38.58,24.77
  Top 0.406: 37.1,38.45 IC1.1 | IC6.2 30.48,35.24 31.48,34.24 C22.2 | EEP.5 46.67,37.15 44.4,39.42
  Top 0.61: T3.3V.2 47.62,36.83 USB.GND1
  Top 0.813: 31.43,33.92 v31.43,32.38 v30.48,32.38 | T1.2V.2 31.43,46.99 35.56,46.99
  Top 1.778: v25.4,48.26 v2.54,48.26 v2.54,2.54
  Bottom 0.305: v34.61,23.02 34.77,23.18
  Bottom 1.778: 27.94,48.26 v2.54,48.26 v2.54,2.54 | v25.4,40.64 27.46,40.64
  other vias: 40.01,41.59 40.01,40.64 40.01,39.69 35.56,41.91 34.61,41.91 33.66,41.91 36.2,37.78 35.56,38.42 36.2,38.89 36.35,29.84 31.91,25.08 43.97,47.15 45.09,47.15 46.2,47.15 44.13,38.58 45.09,38.58 46.04,38.58
  pour Top (isolate 0.406, rank 4): 24.45,49.69 24.45,48.42 26.83,46.04 26.67,37.15 49.53,37.15 49.53,49.69
  pour Top (isolate 0.203, rank 2): 29.21,32.54 36.99,32.54 36.83,23.81 29.21,23.81
  pour Bottom (isolate 0.254, rank 5): 26.83,49.53 26.83,0.32 49.53,0.32 49.53,49.53
N$1
  Top 0.305: RN1.1 42.48,31.5 42.86,31.11 EEP.1 42.86,26.04 40.64,23.81 40.64,21.91 40.4,21.66 IC2.63
N$2  (via drill 0.4)
  Top 0.305: v36.51,45.72 D1.6 | v33.97,32.7 33.97,32.38 33.02,31.43 R2.1
  Bottom 0.305: v33.97,32.7 33.97,33.02 34.92,33.97 37.15,33.97 38.42,35.24 38.42,39.69 36.51,41.59 36.51,43.18 35.56,44.13 35.56,44.77 v36.51,45.72
N$3  (via drill 0.4)
  Top 0.305: v36.51,44.45 D1.7 | v34.92,32.7 R1.2
  Bottom 0.305: v34.92,32.7 35.56,33.34 37.47,33.34 39.05,34.92 39.05,40.01 37.15,41.91 37.15,43.81 v36.51,44.45
N$4
  Top 0.305: RN1.2 42.63,32.3 43.18,31.75 43.5,31.75 44.13,31.11 EEP.2 44.13,26.51 41.27,23.65 41.27,21.59 40.85,21.16 IC2.62
N$5
  Top 0.305: RN1.3 42.78,33.1 43.5,32.38 44.13,32.38 45.4,31.11 | 45.4,31.11 EEP.3 45.4,26.99 41.91,23.5 41.91,21.27 41.3,20.66 IC2.61 | R3.2 47.84,31.75 46.04,31.75 45.4,31.11
N$6
  Top 0.305: R3.1 46.77,29.31 46.67,29.21 EEP.4
N$7
  Top 0.406: USB.5 43.78,44.16 40.96,46.99 D1.4
N$8
  Top 0.406: USB.3 43.81,42.86 40.96,45.72 D1.3
N$9
  Top 0.305: IC2.6 35.22,25.01 R4.2
N$10
  Top 0.406: USB.2 43.51,42.21 41.27,44.45 D1.2
N$11
  Top 0.406: 33.34,40.79 F1.1 32.7,41.11 32.7,42.86 33.02,43.18 D1.8
N$12
  Top 0.813: C21.2 31.16,39.45 IC6.4
N$13  (via drill 1.27 pad 1.91)
  other vias: 22.86,48.26
N$14
  Top 0.406: LED4.A R5.2
N$15  (via drill 1.27 pad 1.91)
  other vias: 5.08,48.26
N$16  (via drill 1.27 pad 1.91)
  other vias: 7.62,48.26
N$17  (via drill 1.27 pad 1.91)
  other vias: 10.16,48.26
N$18
  Top 0.305: IC2.43 35.22,11.29 36.67,9.84 42.23,9.84 42.86,9.21 45.4,9.21 X1.5
N$19
  Top 0.305: X1.6 36.83,10.48 35.72,11.59 IC2.44
N$20  (via drill 0.3)
  Top 0.305: v42.86,11.75 42.23,11.11 36.99,11.11 36.22,11.88 IC2.45
  Bottom 0.305: X1.7 45.4,11.75 v42.86,11.75
N$21
  Top 0.305: X1.8 42.86,13.02 41.59,11.75 37.15,11.75 36.72,12.17 IC2.46
N$22
  Top 0.305: X1.9 45.4,14.29 43.18,14.29 41.27,12.38 37.79,12.38 37.72,12.45 IC2.48
N$23
  Top 0.305: X1.10 43.52,16.16 IC2.52
N$24
  Top 0.305: X1.11 45.4,16.82 43.34,16.82 43.18,16.67 IC2.53
N$25
  Top 0.305: X1.12 43.81,18.1 42.88,17.16 IC2.54
N$26  (via drill 0.3)
  Top 0.305: v42.7,18.1 42.27,17.66 IC2.55
  Bottom 0.305: X1.13 45.4,19.37 43.34,19.37 42.7,18.73 v42.7,18.1
N$27
  Top 0.305: IC2.57 42.16,18.66 42.86,19.37 43.5,19.37 44.13,20 X1.14
N$28  (via drill 0.3)
  Top 0.305: v42.7,20.16 41.71,19.16 IC2.58
  Bottom 0.305: X1.15 45.4,21.91 43.34,21.91 42.7,21.27 v42.7,20.16
N$29
  Top 0.305: IC2.59 41.26,19.66 42.55,20.95 42.55,21.59 X1.16
N$30  (via drill 1.27 pad 1.91)
  other vias: 12.7,48.26
N$31  (via drill 1.27 pad 1.91)
  other vias: 15.24,48.26
N$32  (via drill 1.27 pad 1.91)
  other vias: 17.78,48.26
N$33  (via drill 1.27 pad 1.91)
  other vias: 20.32,48.26
N$34  (via drill 1.27 pad 1.91)
  other vias: 22.86,45.72
N$35  (via drill 1.27 pad 1.91)
  other vias: 2.54,45.72
N$36  (via drill 1.27 pad 1.91)
  other vias: 5.08,45.72
N$37  (via drill 1.27 pad 1.91)
  other vias: 7.62,45.72
N$38  (via drill 1.27 pad 1.91)
  other vias: 10.16,45.72
N$39  (via drill 1.27 pad 1.91)
  other vias: 12.7,45.72
N$40  (via drill 1.27 pad 1.91)
  other vias: 15.24,45.72
N$41  (via drill 1.27 pad 1.91)
  other vias: 17.78,45.72
N$42  (via drill 1.27 pad 1.91)
  other vias: 20.32,45.72
N$43  (via drill 1.27 pad 1.91)
  other vias: 22.86,43.18
N$44  (via drill 1.27 pad 1.91)
  other vias: 2.54,43.18
N$45  (via drill 1.27 pad 1.91)
  other vias: 5.08,43.18
N$46  (via drill 1.27 pad 1.91)
  other vias: 7.62,43.18
N$47  (via drill 1.27 pad 1.91)
  other vias: 10.16,43.18
N$48  (via drill 1.27 pad 1.91)
  other vias: 12.7,43.18
N$49  (via drill 1.27 pad 1.91)
  other vias: 15.24,43.18
N$50  (via drill 1.27 pad 1.91)
  other vias: 17.78,43.18
N$51  (via drill 1.27 pad 1.91)
  other vias: 20.32,43.18
N$52  (via drill 1.27 pad 1.91)
  other vias: 22.86,40.64
N$53  (via drill 1.27 pad 1.91)
  other vias: 2.54,40.64
N$54  (via drill 1.27 pad 1.91)
  other vias: 5.08,40.64
N$55  (via drill 1.27 pad 1.91)
  other vias: 7.62,40.64
N$56  (via drill 1.27 pad 1.91)
  other vias: 10.16,40.64
N$57  (via drill 1.27 pad 1.91)
  other vias: 12.7,40.64
N$58  (via drill 1.27 pad 1.91)
  other vias: 15.24,40.64
N$59  (via drill 1.27 pad 1.91)
  other vias: 17.78,40.64
N$60  (via drill 1.27 pad 1.91)
  other vias: 20.32,40.64
N$61  (via drill 1.27 pad 1.91)
  other vias: 22.86,38.1
N$62  (via drill 1.27 pad 1.91)
  other vias: 2.54,38.1
N$63  (via drill 1.27 pad 1.91)
  other vias: 5.08,38.1
N$64  (via drill 1.27 pad 1.91)
  other vias: 7.62,38.1
N$65  (via drill 1.27 pad 1.91)
  other vias: 10.16,38.1
N$66  (via drill 1.27 pad 1.91)
  other vias: 12.7,38.1
N$67  (via drill 1.27 pad 1.91)
  other vias: 15.24,38.1
N$68  (via drill 1.27 pad 1.91)
  other vias: 17.78,38.1
N$69  (via drill 1.27 pad 1.91)
  other vias: 20.32,38.1
N$70  (via drill 1.27 pad 1.91)
  other vias: 22.86,35.56
N$71  (via drill 1.27 pad 1.91)
  other vias: 2.54,35.56
N$72  (via drill 1.27 pad 1.91)
  other vias: 5.08,35.56
N$73  (via drill 1.27 pad 1.91)
  other vias: 7.62,35.56
N$74  (via drill 1.27 pad 1.91)
  other vias: 10.16,35.56
N$75  (via drill 1.27 pad 1.91)
  other vias: 12.7,35.56
N$76  (via drill 1.27 pad 1.91)
  other vias: 15.24,35.56
N$77  (via drill 1.27 pad 1.91)
  other vias: 17.78,35.56
N$78  (via drill 1.27 pad 1.91)
  other vias: 20.32,35.56
N$79  (via drill 1.27 pad 1.91)
  other vias: 22.86,33.02
N$80  (via drill 1.27 pad 1.91)
  other vias: 2.54,33.02
N$81  (via drill 1.27 pad 1.91)
  other vias: 5.08,33.02
N$82  (via drill 1.27 pad 1.91)
  other vias: 7.62,33.02
N$83  (via drill 1.27 pad 1.91)
  other vias: 10.16,33.02
N$84  (via drill 1.27 pad 1.91)
  other vias: 12.7,33.02
N$85  (via drill 1.27 pad 1.91)
  other vias: 15.24,33.02
N$86  (via drill 1.27 pad 1.91)
  other vias: 17.78,33.02
N$87  (via drill 1.27 pad 1.91)
  other vias: 20.32,33.02
N$89  (via drill 1.27 pad 1.91)
  other vias: 2.54,30.48
N$90  (via drill 1.27 pad 1.91)
  other vias: 5.08,30.48
N$91  (via drill 1.27 pad 1.91)
  other vias: 7.62,30.48
N$92  (via drill 1.27 pad 1.91)
  other vias: 10.16,30.48
N$93  (via drill 1.27 pad 1.91)
  other vias: 12.7,30.48
N$94  (via drill 1.27 pad 1.91)
  other vias: 15.24,30.48
N$95  (via drill 1.27 pad 1.91)
  other vias: 17.78,30.48
N$96  (via drill 1.27 pad 1.91)
  other vias: 20.32,30.48
N$97  (via drill 1.27 pad 1.91)
  other vias: 22.86,30.48
N$98  (via drill 1.27 pad 1.91)
  other vias: 2.54,27.94
N$99  (via drill 1.27 pad 1.91)
  other vias: 5.08,27.94
N$100  (via drill 1.27 pad 1.91)
  other vias: 7.62,27.94
N$101  (via drill 1.27 pad 1.91)
  other vias: 10.16,27.94
N$102  (via drill 1.27 pad 1.91)
  other vias: 12.7,27.94
N$103  (via drill 1.27 pad 1.91)
  other vias: 15.24,27.94
N$104  (via drill 1.27 pad 1.91)
  other vias: 17.78,27.94
N$105  (via drill 1.27 pad 1.91)
  other vias: 20.32,27.94
N$106  (via drill 1.27 pad 1.91)
  other vias: 22.86,27.94
N$107  (via drill 1.27 pad 1.91)
  other vias: 2.54,25.4
N$108  (via drill 1.27 pad 1.91)
  other vias: 5.08,25.4
N$109  (via drill 1.27 pad 1.91)
  other vias: 7.62,25.4
N$110  (via drill 1.27 pad 1.91)
  other vias: 10.16,25.4
N$111  (via drill 1.27 pad 1.91)
  other vias: 12.7,25.4
N$112  (via drill 1.27 pad 1.91)
  other vias: 15.24,25.4
N$113  (via drill 1.27 pad 1.91)
  other vias: 17.78,25.4
N$114  (via drill 1.27 pad 1.91)
  other vias: 20.32,25.4
N$115  (via drill 1.27 pad 1.91)
  other vias: 22.86,25.4
N$116  (via drill 1.27 pad 1.91)
  other vias: 2.54,22.86
N$117  (via drill 1.27 pad 1.91)
  other vias: 5.08,22.86
N$118  (via drill 1.27 pad 1.91)
  other vias: 7.62,22.86
N$119  (via drill 1.27 pad 1.91)
  other vias: 10.16,22.86
N$120  (via drill 1.27 pad 1.91)
  other vias: 12.7,22.86
N$121  (via drill 1.27 pad 1.91)
  other vias: 15.24,22.86
N$122  (via drill 1.27 pad 1.91)
  other vias: 17.78,22.86
N$123  (via drill 1.27 pad 1.91)
  other vias: 20.32,22.86
N$124  (via drill 1.27 pad 1.91)
  other vias: 22.86,22.86
N$125  (via drill 1.27 pad 1.91)
  other vias: 2.54,20.32
N$126  (via drill 1.27 pad 1.91)
  other vias: 5.08,20.32
N$127  (via drill 1.27 pad 1.91)
  other vias: 7.62,20.32
N$128  (via drill 1.27 pad 1.91)
  other vias: 10.16,20.32
N$129  (via drill 1.27 pad 1.91)
  other vias: 12.7,20.32
N$130  (via drill 1.27 pad 1.91)
  other vias: 15.24,20.32
N$131  (via drill 1.27 pad 1.91)
  other vias: 17.78,20.32
N$132  (via drill 1.27 pad 1.91)
  other vias: 20.32,20.32
N$133  (via drill 1.27 pad 1.91)
  other vias: 22.86,20.32
N$134  (via drill 1.27 pad 1.91)
  other vias: 2.54,17.78
N$135  (via drill 1.27 pad 1.91)
  other vias: 5.08,17.78
N$136  (via drill 1.27 pad 1.91)
  other vias: 7.62,17.78
N$137  (via drill 1.27 pad 1.91)
  other vias: 10.16,17.78
N$138  (via drill 1.27 pad 1.91)
  other vias: 12.7,17.78
N$139  (via drill 1.27 pad 1.91)
  other vias: 15.24,17.78
N$140  (via drill 1.27 pad 1.91)
  other vias: 17.78,17.78
N$141  (via drill 1.27 pad 1.91)
  other vias: 20.32,17.78
N$142  (via drill 1.27 pad 1.91)
  other vias: 22.86,17.78
N$143  (via drill 1.27 pad 1.91)
  other vias: 2.54,15.24
N$144  (via drill 1.27 pad 1.91)
  other vias: 5.08,15.24
N$145  (via drill 1.27 pad 1.91)
  other vias: 7.62,15.24
N$146  (via drill 1.27 pad 1.91)
  other vias: 10.16,15.24
N$147  (via drill 1.27 pad 1.91)
  other vias: 12.7,15.24
N$148  (via drill 1.27 pad 1.91)
  other vias: 15.24,15.24
N$149  (via drill 1.27 pad 1.91)
  other vias: 17.78,15.24
N$150  (via drill 1.27 pad 1.91)
  other vias: 20.32,15.24
N$151  (via drill 1.27 pad 1.91)
  other vias: 22.86,15.24
N$152  (via drill 1.27 pad 1.91)
  other vias: 2.54,12.7
N$153  (via drill 1.27 pad 1.91)
  other vias: 5.08,12.7
N$154  (via drill 1.27 pad 1.91)
  other vias: 7.62,12.7
N$155  (via drill 1.27 pad 1.91)
  other vias: 10.16,12.7
N$156  (via drill 1.27 pad 1.91)
  other vias: 12.7,12.7
N$157  (via drill 1.27 pad 1.91)
  other vias: 15.24,12.7
N$158  (via drill 1.27 pad 1.91)
  other vias: 17.78,12.7
N$159  (via drill 1.27 pad 1.91)
  other vias: 20.32,12.7
N$160  (via drill 1.27 pad 1.91)
  other vias: 22.86,12.7
N$161  (via drill 1.27 pad 1.91)
  other vias: 2.54,10.16
N$162  (via drill 1.27 pad 1.91)
  other vias: 5.08,10.16
N$163  (via drill 1.27 pad 1.91)
  other vias: 7.62,10.16
N$164  (via drill 1.27 pad 1.91)
  other vias: 10.16,10.16
N$165  (via drill 1.27 pad 1.91)
  other vias: 12.7,10.16
N$166  (via drill 1.27 pad 1.91)
  other vias: 15.24,10.16
N$167  (via drill 1.27 pad 1.91)
  other vias: 17.78,10.16
N$168  (via drill 1.27 pad 1.91)
  other vias: 20.32,10.16
N$169  (via drill 1.27 pad 1.91)
  other vias: 22.86,10.16
N$170  (via drill 1.27 pad 1.91)
  other vias: 2.54,7.62
N$171  (via drill 1.27 pad 1.91)
  other vias: 5.08,7.62
N$172  (via drill 1.27 pad 1.91)
  other vias: 7.62,7.62
N$173  (via drill 1.27 pad 1.91)
  other vias: 10.16,7.62
N$174  (via drill 1.27 pad 1.91)
  other vias: 12.7,7.62
N$175  (via drill 1.27 pad 1.91)
  other vias: 15.24,7.62
N$176  (via drill 1.27 pad 1.91)
  other vias: 17.78,7.62
N$177  (via drill 1.27 pad 1.91)
  other vias: 20.32,7.62
N$178  (via drill 1.27 pad 1.91)
  other vias: 22.86,7.62
N$179  (via drill 1.27 pad 1.91)
  other vias: 2.54,5.08
N$180  (via drill 1.27 pad 1.91)
  other vias: 5.08,5.08
N$181  (via drill 1.27 pad 1.91)
  other vias: 7.62,5.08
N$182  (via drill 1.27 pad 1.91)
  other vias: 10.16,5.08
N$183  (via drill 1.27 pad 1.91)
  other vias: 12.7,5.08
N$184  (via drill 1.27 pad 1.91)
  other vias: 15.24,5.08
N$185  (via drill 1.27 pad 1.91)
  other vias: 17.78,5.08
N$186  (via drill 1.27 pad 1.91)
  other vias: 20.32,5.08
N$187  (via drill 1.27 pad 1.91)
  other vias: 25.4,17.78
N$188  (via drill 1.27 pad 1.91)
  other vias: 25.4,2.54
N$189  (via drill 1.27 pad 1.91)
  other vias: 5.08,2.54
N$190  (via drill 1.27 pad 1.91)
  other vias: 7.62,2.54
N$191  (via drill 1.27 pad 1.91)
  other vias: 10.16,2.54
N$192  (via drill 1.27 pad 1.91)
  other vias: 12.7,2.54
N$193  (via drill 1.27 pad 1.91)
  other vias: 15.24,2.54
N$194  (via drill 1.27 pad 1.91)
  other vias: 17.78,2.54
N$195  (via drill 1.27 pad 1.91)
  other vias: 20.32,2.54
RXD/TDI/DO  (via drill 1.27 pad 1.91)
  Top 0.305: IC2.17 27.21,22.16 26.99,22.38 26.99,23.81 v25.4,25.4
SYSCLK  (via drill 0.3, 1.27 pad 1.91)
  Top 0.305: XO.3 37.22,25.53 IC2.2 37.22,22.62 36.83,22.23 32.07,22.23 v31.59,22.7 | v29.37,26.35 29.37,26.51 v25.4,30.48
  Bottom 0.305: v29.37,26.35 30.8,26.35 31.27,25.88 31.27,24.77 31.43,24.61 31.43,22.86 v31.59,22.7
TCK  (via drill 1.27 pad 1.91)
  Top 0.305: X2.7 29.53,9.84 27.62,9.84 v25.4,7.62
TDI  (via drill 1.27 pad 1.91)
  Top 0.305: X2.5 32.7,9.21 31.11,9.21 29.84,10.48 25.72,10.48 v25.4,10.16
TDO  (via drill 1.27 pad 1.91)
  Top 0.305: X2.3 34.61,9.84 31.43,9.84 30.16,11.11 28.42,11.11 26.83,12.7 v25.4,12.7
TMS  (via drill 1.27 pad 1.91)
  Top 0.305: X2.1 37.78,9.21 36.2,9.21 34.92,10.48 31.59,10.48 30.32,11.75 28.57,11.75 25.4,14.92 v25.4,15.24
TXD/TCK/SCLK  (via drill 1.27 pad 1.91)
  Top 0.305: IC2.16 29.27,24.07 v25.4,27.94
USB-D+
  Top 0.305: IC2.8 34.22,24.67 33.5,25.4 33.5,28.84 33.02,29.37 R2.2
USB-D-
  Top 0.305: IC2.7 34.72,24.97 34.13,25.56 34.13,28.84 R1.1
USB_5V
  Top 0.406: USB.1 42.89,41.56 41.27,43.18 D1.1
VCORE1.8  (via drill 0.3)
  Top 0.305: IC2.37 v32.22,14.28 v32.23,14.29 | IC2.12 32.22,23.34 v32.7,22.86 | v39.69,22.86 39.69,22.23 IC2.64 38.83,22.16 38.58,21.91 38.58,20.95 37.62,20 | 37.62,15.88 38.83,14.66 IC2.49
  Top 0.61: v32.23,14.29 33.81,15.88 37.62,15.88 37.62,20 v32.7,20
  Bottom 0.305: v32.23,14.29 32.83,14.29 C5.1 | C4.1 39.41,22.58 v39.69,22.86 | C3.1 32.7,23.69 v32.7,22.86
  Bottom 0.61: v32.7,20 v32.7,22.86
VPHY  (via drill 0.3)
  Top 0.305: IC2.4 36.22,23.36 v36.51,22.86
  Bottom 0.305: L2.2 37.62,21.91 37.78,21.75 C13.1
  Bottom 0.61: C13.1 C14.1 36.35,22.7 v36.51,22.86
VPLL  (via drill 0.3)
  Top 0.305: IC2.9 33.72,22.93 v33.66,22.86
  Bottom 0.305: L1.2 36.2,23.5 35.08,22.38 C12.1
  Bottom 0.61: v33.66,22.86 33.81,22.7 C11.1 C12.1

### Text on the board
tPlace: +3.3V
bPlace: SERIAL-DEV 1A / MRHW2015
tNames: GND | +1.2V | +3.3V | 12 / MHz | SCK | DO | [A] | DI | !CS | TMS | TDO | TDI | [B] | FT2232HL | TCK | 3.3V / GND | TCK | TDI | TDO | TMS | GND
bNames: 12 / MHz | TXD / TCK | RXD / TDI | !RTS! / TDO | BC7 | BC6 | !CTS! / TMS | BC1 | !CS | BC0 | DI | BD7 | BD6 | DO | SCK | BD1 | BD0 | FT2232H 2CH SPI / I2C UART JTAG FIFO
Measures: units mm